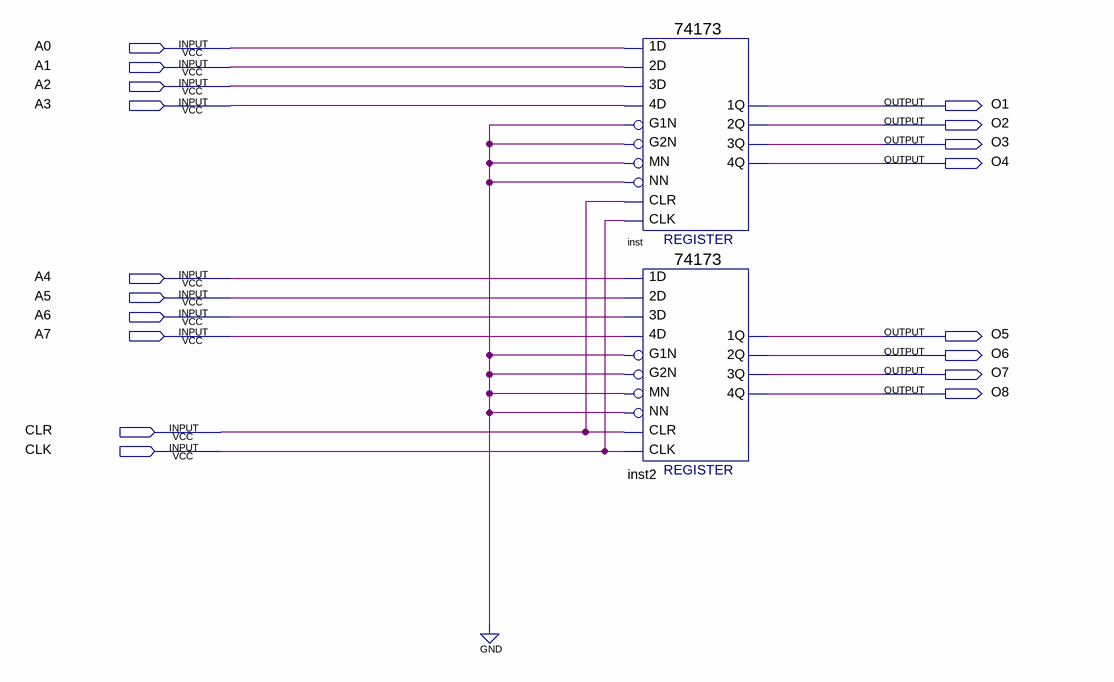
[diagram p0: schematic sheet]
// Quartus schematic REGISTER8.bdf as structural Verilog: 2 symbols, 18 pins
module REGISTER8 (
  input  A0,
  input  A1,
  input  A2,
  input  A3,
  input  A4,
  input  A5,
  input  A6,
  input  A7,
  input  CLR,
  input  CLK,
  output O1,
  output O2,
  output O3,
  output O4,
  output O5,
  output O6,
  output O7,
  output O8
);

  \74173  inst (
    .\3D (A2), .MN(1'b0), .\1D (A0), .\2D (A1), .\4D (A3), .G1N(1'b0), .G2N(1'b0), .NN(1'b0), .CLR(CLR),
    .CLK(CLK), .\3Q (O3), .\2Q (O2), .\1Q (O1), .\4Q (O4));
  \74173  inst2 (
    .\3D (A6), .MN(1'b0), .\1D (A4), .\2D (A5), .\4D (A7), .G1N(1'b0), .G2N(1'b0), .NN(1'b0), .CLR(CLR),
    .CLK(CLK), .\3Q (O7), .\2Q (O6), .\1Q (O5), .\4Q (O8));
endmodule
